# Altium project dawgg.PrjPcb
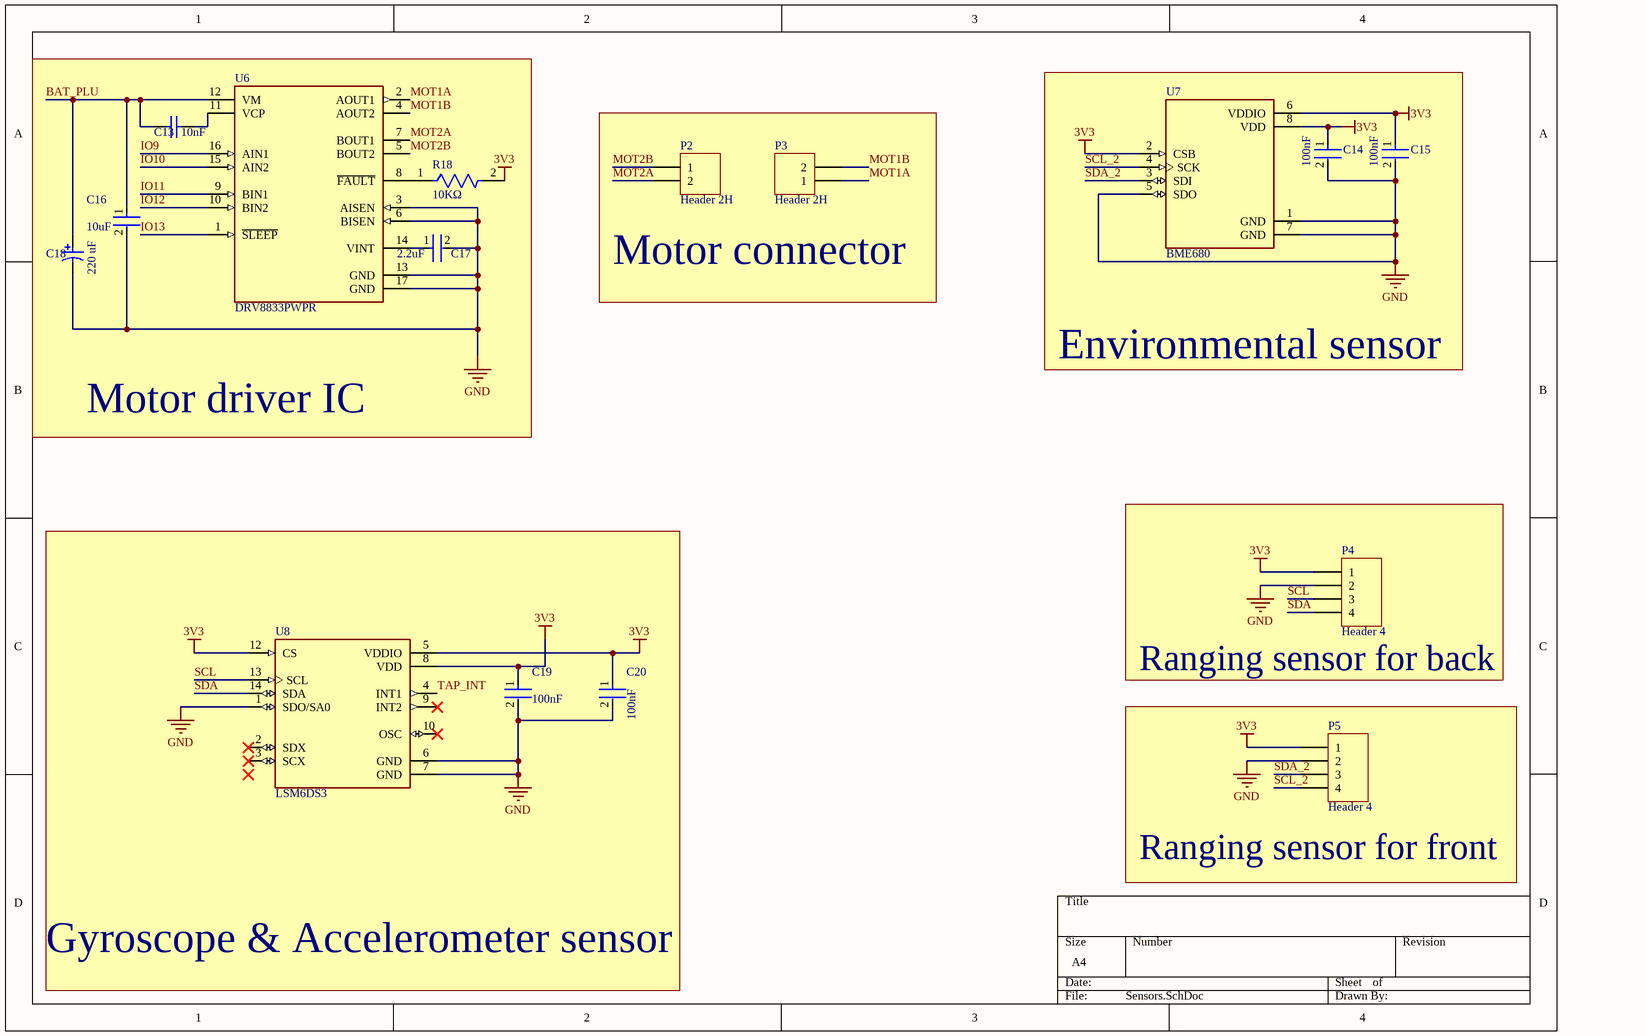
[diagram p0: Sensors.SchDoc]
3 sheets, 65 parts. Net scope: global (net labels, ports and power ports of the same name join across sheets).
Board file: PCB1.PcbDoc
Sheets:
  Sensors.SchDoc
  Power.SchDoc
  mcu.SchDoc

## Sheet Sensors.SchDoc
size A4; SheetNumber: 1; SheetTotal: 3

### Parts
C13  value 10nF  [CAPC0805(2012)145_N]  (hidden comment: CAP 10nF 50V 0805(2012))
C14  Capacitance: 100nF  [FP-CC0805-EB-IPC_B]  (hidden comment: CC0805KKX7RYBB104)
C15  Capacitance: 100nF  [FP-CC0805-EB-IPC_B]  (hidden comment: CC0805KKX7RYBB104)
C16  Capacitance: 10uF  [FP-C0805C106J8RACAUTO-MFG]  (hidden comment: C0805C106J8RACAUTO)
C17  Capacitance: 2.2uF  [FP-0805-L_2_01_0_2-W_1_25-MFG]  (hidden comment: 08053C225K4Z2A)
C18  Rated Capacitance: 220 uF  [NIC-CAPA2-8X10_V]  (hidden comment: UUD1V221MNL1GS)
C19  Capacitance: 100nF  [FP-CC0805-EB-IPC_B]  (hidden comment: CC0805KKX7RYBB104)
C20  Capacitance: 100nF  [FP-CC0805-EB-IPC_B]  (hidden comment: CC0805KKX7RYBB104)
P2  Header 2H  [HDR1X2H]
P3  Header 2H  [HDR1X2H]
P4  Header 4  [HDR1X4]
P5  Header 4  [HDR1X4]
R18  value 10KΩ  [FP-RT0805-IPC_B]  (hidden comment: RT0805FRD0710KL)
U6  DRV8833PWPR  [FP-PWP0016C-IPC_B]
U7  BME680  [PSON80P300X300X100-8N]
U8  LSM6DS3  [PQFN50P300X250X86-14N]

### Blocks framed on the sheet
Motor driver IC: C13 C16-C18 R18 U6
Environmental sensor: C14 C15 U7
Motor connector: P2 P3
Ranging sensor for back: P4
Gyroscope & Accelerometer sensor: C19 C20 U8
Ranging sensor for front: P5

### Nets
3V3: C14.1 C15.1 C19.1 C20.1 P4.1 P5.1 R18.2 U7.2(CSB) U7.6(VDDIO) U7.8(VDD) U8.5(VDDIO) U8.8(VDD) U8.12(CS)
GND: C14.2 C15.2 C16.2 C17.2 C18.2 C19.2 C20.2 P4.2 P5.2 U6.3(AISEN) U6.6(BISEN) U6.13(GND) U6.17(GND) U7.1(GND) U7.5(SDO) U7.7(GND) U8.1(SDO/SA0) U8.6(GND) U8.7(GND)
BAT_PLU: C13.1 C16.1 C18.1 U6.12(VM)
IO9: U6.16(AIN1)
IO10: U6.15(AIN2)
IO11: U6.9(BIN1)
IO12: U6.10(BIN2)
IO13: U6.1(~{SLEEP})
MOT1A: P3.1 U6.2(AOUT1)
MOT1B: P3.2 U6.4(AOUT2)
MOT2A: P2.2 U6.7(BOUT1)
MOT2B: P2.1 U6.5(BOUT2)
SCL: P4.3 U8.13(SCL)
SCL_2: P5.4 U7.4(SCK)
SDA: P4.4 U8.14(SDA)
SDA_2: P5.3 U7.3(SDI)
TAP_INT: U8.4(INT1)
NetC13_2: C13.2 U6.11(VCP)
NetC17_1: C17.1 U6.14(VINT)
NetR18_1: R18.1 U6.8(~{FAULT})

Not connected (* = marked no-connect by the designer): U8 2(SDX)* 3(SCX)* 9(INT2)* 10(OSC)*

### Library data of the parts
C13 = CMP-1036-03843-1: CAP 10nF 50V ±10% 0805 (2012 Metric) Thickness 1.45mm SMD; Case-EIA: 0805; Tolerance: Â±10%; Case-Metric: 2012; Technology: SMT; Max Thickness: 1.45 mm; Rated Voltage: 50 V; LCSC Part: C377773
C14 C15 C19 C20 = CMP-00621-107850848-1: CC0805KKX7RYBB104 Capacitor Ceramic 0.01uF 250V X7R 10% 0805 T/R; Material: Ceramic; Max Operating Temperature: 125°C; Tolerance: 10%; Case/Package: 0805; NexarPartId: 107850848; Height: 1.45mm; Min Operating Temperature: -55°C; Voltage Rating: 250V; LCSC Part: C28233
C16 = CMP-03020-034708-1: CAP CER 10UF 10V X7R 0805; Tolerance: 5%; Mount: Surface Mount; Voltage Rating: 10V; Max Operating Temperature: 125°C; Min Operating Temperature: -55°C; Case/Package: 0805; RoHS Compliant: Yes; Packaging: Tape and Reel; Case Code (Imperial): 0805; Case Code (Metric): 2012; Ratings: AEC-Q200; LCSC Part: C15850
C17 = CMP-04427-000048-1: CAP CER 2.2UF 25V X7R 0805; Tolerance: 10%; Voltage Rating: 25V; Packaging: Tape and Reel; Case/Package: 0805; Case Code (Imperial): 0805; Max Operating Temperature: 125°C; Features: Soft Termination; Ratings: AEC-Q200; Mount: Surface Mount; Case Code (Metric): 2012; Min Operating Temperature: -55°C; LCSC Part: C377773
C18 = CMP-0687-00080-1: Aluminum Electrolytic Capacitor, UD Series, Low Impedance, 220 uF, 35 V, + / - 20%, -55 to 105 degC, Chip Type, 8 x 10 mm D x L, Pb-Free, Reel; Manufacturer: Nichicon; Tolerance Rated Capacitance: -20 to 20%; Rated Voltage: 35 V; Packing: Dia382mm Reel; Impedance: 0.17 Ohm; Endurance Time: 5000 h; Rated Ripple Current (at 100kHz): 450 mA; ComponentLink3URL: http://products.nichicon.co.jp/en/pdf/XJA043/e-ud.pdf; DatasheetVersion: 08/2012; PackageDescription: 2-Pin Surface Mount Device, Diameter 8 mm, Height 10 mm, Pitch 6.5 mm; Length: 10 mm; ComponentLink3Description: Package Specification; RoHS: TRUE; ComponentLink1URL: http://www.nichicon.co.jp/; PartNumber: UUD1V221MNL1GS; ComponentLink2Description: Datasheet; ComponentLink2URL: http://products.nichicon.co.jp/en/pdf/XJA043/e-ud.pdf; PackageReference: CAPAE-D8H10; Diameter: 8 mm; Mounting Technology: Surface Mount; ComponentLink1Description: Manufacturer URL; LCSC Part: C2836441
P2 P3 = Header 2H: Header, 2-Pin, Right Angle; LatestRevisionDate: 17-Jul-2002; LatestRevisionNote: Re-released for DXP Platform.; Publisher: Altium Limited; LCSC Part: C32713261
P4 P5 = Header 4: Header, 4-Pin; LatestRevisionDate: 17-Jul-2002; LatestRevisionNote: Re-released for DXP Platform.; Publisher: Altium Limited; LCSC Part: C42431787
R18 = CMP-03412-035478-1: RES SMD 10K OHM 1% 1/8W 0805; Manufacturer: Yageo; Tolerance: 0.0001; Temperature Coefficient: 25 ppm/°C; Power Rating: 0.125W; Voltage Rating: 150V; RoHS: TRUE; Footprint Url: http://www.yageo.com/exep/pages/download/literatures/PYu-R_Mount_10.pdf; Series: RT; Octopart: https://octopart.com/rt0805frd0710kl-yageo-71399701; Digikey Description: RES SMD 10K OHM 1% 1/8W 0805; Composition: Thin Film; Manufacturer Part Number: RT0805FRD0710KL; Device Class L1: Passive Components; Automotive: No; ComponentLink2Description: Datasheet; Ipc Land Pattern Name: RESC200125X50; Device Class L2: Resistors; Resistance: 10KΩ; Temperature Range Low: -55°C; Device Class L3: Chip SMD Resistors; ComponentLink2URL: http://www.yageo.com/documents/recent/PYu-RT_1-to-0.01_RoHS_L_9.pdf; Temperature: -55°C to +155°C; Category: Res; Temperature Range High: +155°C; Lead Free: Yes; Package: RT0805; Height: 0.6mm; LCSC Part: C17414
U6 = CMP-1529-00004-3: IC MOTOR DRIVER PAR 16HTSSOP; Supply Current: 3mA; Max Output Current: 2A; Interface: PWM; Output Current: 1.5A; Max Supply Voltage: 10.8V; Fault Protection: Over Temperature; Number of Outputs: 2; Min Supply Voltage: 2.7V; Nominal Supply Current: 3mA; Series: DRV8833; Min Operating Temperature: -40°C; Package Quantity: 2000; Packaging: Tape and Reel; Case/Package: HTSSOP; Output Current per Channel: 1.5A; RoHS Compliant: Yes; RMS Current (Irms): 1.5A; Max Operating Temperature: 85°C; Technology: NMOS; Number of Pins: 16; Radiation Hardening: No; Lead Free: Lead Free; REACH SVHC: No SVHC; LCSC Part: C50506
U7 = BME680: Gas, Humidity, Pressure, Temperature Sensor I2C, SPI Output; MF: Bosch Sensortec; SnapEDA_Link: https://www.snapeda.com/parts/BME680/Bosch+Sensortec/view-part/?ref=snap; Package: LGA-8 Bosch Tools; Value: *; MP: BME680; Check_prices: https://www.snapeda.com/parts/BME680/Bosch+Sensortec/view-part/?ref=eda; LCSC Part: C125972
U8 = LSM6DS3: Accelerometer, Gyroscope, Temperature, 6 Axis Sensor IÂ²C, SPI Output; MF: STMicroelectronics; Value: *; SnapEDA_Link: https://www.snapeda.com/parts/LSM6DS3/STMicroelectronics/view-part/?ref=snap; MP: LSM6DS3; Check_prices: https://www.snapeda.com/parts/LSM6DS3/STMicroelectronics/view-part/?ref=eda; Purchase-URL: https://pricing.snapeda.com/search/part/LSM6DS3/?ref=eda; Availability: In Stock; Price: None; Package: Package; LCSC Part: LSM6DS3TR-C

## Sheet Power.SchDoc
size A4; SheetNumber: 2; SheetTotal: 3; SPICEModelCacheVEIOBZSK: <root> / <DocumentId>VEIOBZSK</DocumentId> / </root>
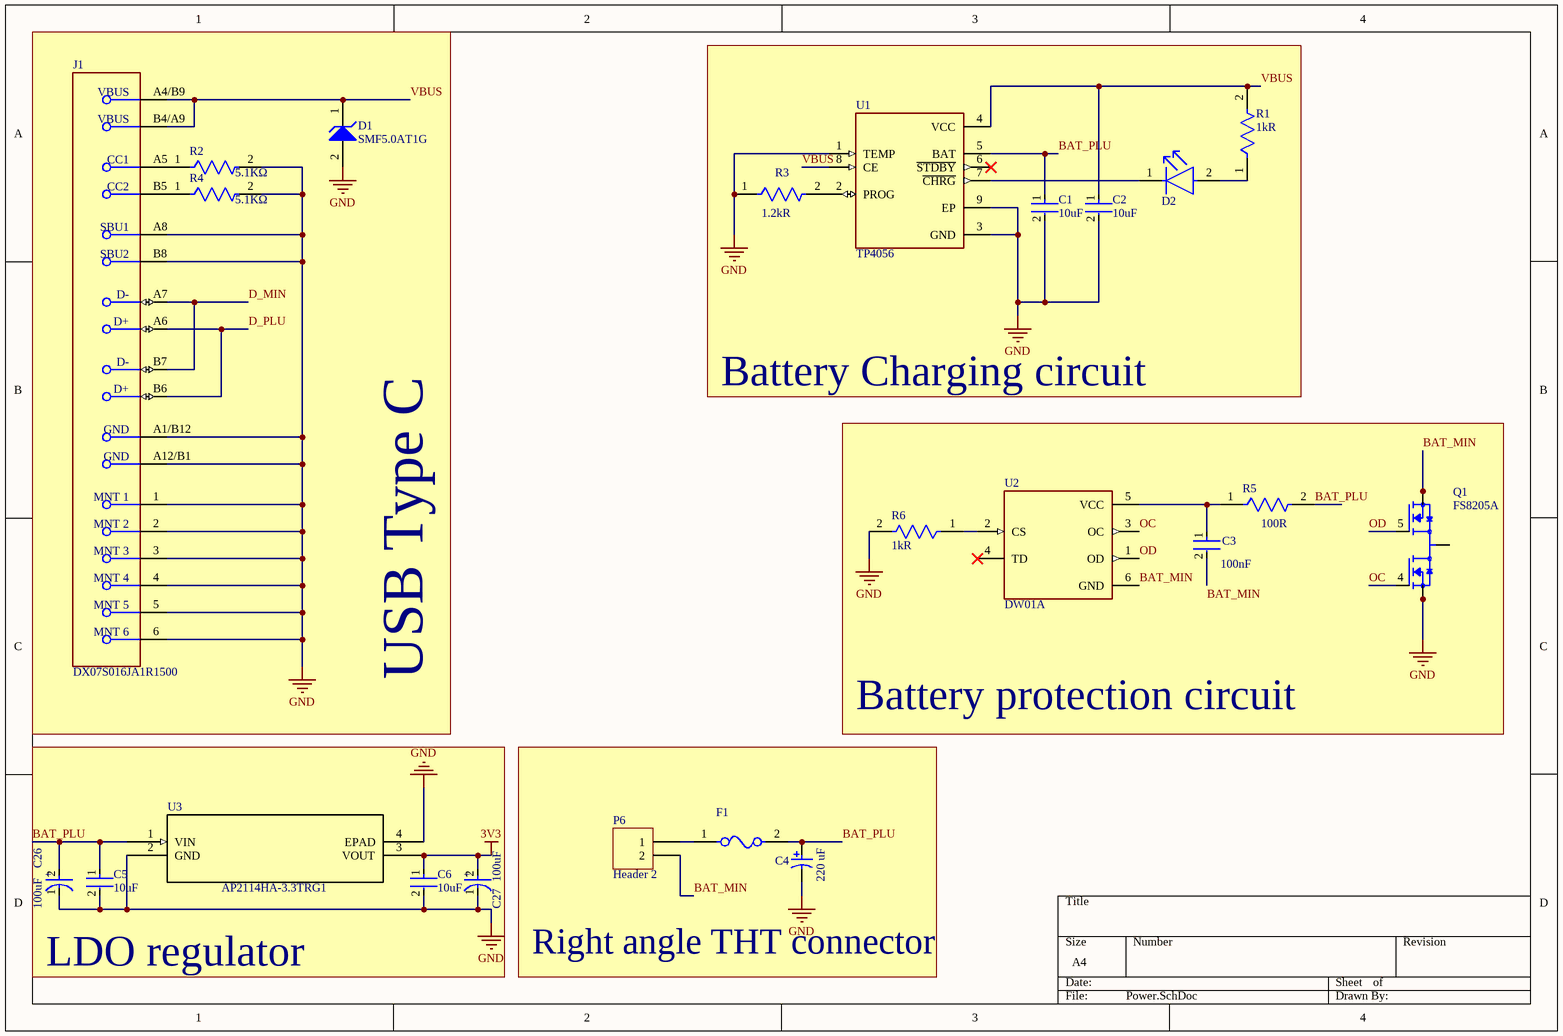
[diagram p1: Power.SchDoc]

### Parts
C1  Capacitance: 10uF  [FP-C0805C106J8RACAUTO-IPC_B]  (hidden comment: C0805C106J8RACAUTO)
C2  Capacitance: 10uF  [FP-C0805C106J8RACAUTO-MFG]  (hidden comment: C0805C106J8RACAUTO)
C3  Capacitance: 100nF  [FP-CC0805-EB-IPC_B]  (hidden comment: CC0805KKX7RYBB104)
C4  Rated Capacitance: 220 uF  [NIC-CAPA2-8X10_V]  (hidden comment: UUD1V221MNL1GS)
C5  Capacitance: 10uF  [FP-C0805C106J8RACAUTO-IPC_B]  (hidden comment: C0805C106J8RACAUTO)
C6  Capacitance: 10uF  [FP-C0805C106J8RACAUTO-IPC_B]  (hidden comment: C0805C106J8RACAUTO)
C26  Capacitance: 100uF  [FP-POSCAP-D2-MFG]  (hidden comment: 10TPC100M)
C27  Capacitance: 100uF  [FP-POSCAP-D2-MFG]  (hidden comment: 10TPC100M)
D1  SMF5.0AT1G  [ONSC-SOD-123FL-2-498_V]
D2  SML-LXT0805IW-TR  [FP-SML-LXT0805IW-TR-MFG]  (value not drawn)
F1  MF-NSMF200-2  [FP-MF-NSMF200-2-MFG]  (value not drawn)
J1  DX07S016JA1R1500  [FP-DX07S016JA1R1500-MFG]
P6  Header 2  [HDR1X2]
Q1  FS8205A  [SOP65P640X120-8N]
R1  Resistance: 1kR  [FP-MCU0805-IPC_B]  (hidden comment: MCU0805MD1001BP100)
R2  value 5.1KΩ  [FP-AC0805-IPC_B]  (hidden comment: AC0805JR-075K1L)
R3  Resistance: 1.2kR  [FP-RMCF0805-IPC_B]  (hidden comment: RMCF0805JG1K20)
R4  value 5.1KΩ  [FP-AC0805-IPC_B]  (hidden comment: AC0805JR-075K1L)
R5  Resistance: 100R  [FP-CRCW0805-HPe3-IPC_B]  (hidden comment: CRCW0805100RJNEAHP)
R6  Resistance: 1kR  [FP-MCU0805-IPC_B]  (hidden comment: MCU0805MD1001BP100)
U1  TP4056  [SOP127P600X175-9N]
U2  DW01A  [SOT95P280X145-6N]
U3  AP2114HA-3.3TRG1  [SOT-223_DIO]

### Blocks framed on the sheet
USB Type C: D1 J1 R2 R4
Battery Charging circuit: C1 C2 D2 R1 R3 U1
Battery protection circuit: C3 Q1 R5 R6 U2
LDO regulator: C5 C6 C26 C27 U3
Right angle THT connector: C4 F1 P6

### Nets
3V3: C6.1 C27.2(A) U3.3(VOUT)
GND: C1.2 C2.2 C4.2 C5.2 C6.2 C26.1(C) C27.1(C) D1.2(A) J1.1(MNT_1) J1.2(MNT_2) J1.3(MNT_3) J1.4(MNT_4) J1.5(MNT_5) J1.6(MNT_6) J1.A1/B12(GND) J1.A8(SBU1) J1.A12/B1(GND) J1.B8(SBU2) Q1.2(S1) Q1.3(S1) R2.2 R3.1 R4.2 R6.2 U1.1(TEMP) U1.3(GND) U1.9(EP) U3.2(GND) U3.4(EPAD)
BAT_MIN: C3.2 P6.2 Q1.6(S2) Q1.7(S2) U2.6(GND)
BAT_PLU: C1.1 C4.1 C5.1 C26.2(A) F1.2 R5.2 U1.5(BAT) U3.1(VIN)
D_MIN: J1.A7(D-) J1.B7(D-)
D_PLU: J1.A6(D+) J1.B6(D+)
OC: Q1.4(G1) U2.3(OC)
OD: Q1.5(G2) U2.1(OD)
VBUS: C2.1 D1.1(K) J1.A4/B9(VBUS) J1.B4/A9(VBUS) R1.2 U1.4(VCC) U1.8(CE)
NetC3_1: C3.1 R5.1 U2.5(VCC)
NetD2_1: D2.1(C) U1.7(~{CHRG})
NetD2_2: D2.2(A) R1.1
NetF1_1: F1.1 P6.1
NetJ1_A5: J1.A5(CC1) R2.1
NetJ1_B5: J1.B5(CC2) R4.1
NetQ1_1: Q1.1(D12) Q1.8(D12)
NetR3_2: R3.2 U1.2(PROG)
NetR6_1: R6.1 U2.2(CS)

Not connected (* = marked no-connect by the designer): U1 6(~{STDBY})*; U2 4(TD)*

### Notes on the sheet
- (in symbol CMP-05428-000328-1) +

### Library data of the parts
C1 C2 C5 C6 = CMP-03020-034708-1: CAP CER 10UF 10V X7R 0805; Tolerance: 5%; Mount: Surface Mount; Voltage Rating: 10V; Max Operating Temperature: 125°C; Min Operating Temperature: -55°C; Case/Package: 0805; RoHS Compliant: Yes; Packaging: Tape and Reel; Case Code (Imperial): 0805; Case Code (Metric): 2012; Ratings: AEC-Q200; LCSC Part: C15850
C3 = CMP-00621-107850848-1: as C14 on sheet Sensors; Material: Ceramic; Max Operating Temperature: 125°C; Tolerance: 10%; Case/Package: 0805; NexarPartId: 107850848; Height: 1.45mm; Min Operating Temperature: -55°C; Voltage Rating: 250V; LCSC Part: C28233
C4 = CMP-0687-00080-1: as C18 on sheet Sensors; ComponentLink3URL: http://products.nichicon.co.jp/en/pdf/XJA043/e-ud.pdf; DatasheetVersion: 08/2012; PackageDescription: 2-Pin Surface Mount Device, Diameter 8 mm, Height 10 mm, Pitch 6.5 mm; Length: 10 mm; ComponentLink3Description: Package Specification; RoHS: TRUE; ComponentLink1URL: http://www.nichicon.co.jp/; PartNumber: UUD1V221MNL1GS; ComponentLink2Description: Datasheet; ComponentLink2URL: http://products.nichicon.co.jp/en/pdf/XJA043/e-ud.pdf; PackageReference: CAPAE-D8H10; Diameter: 8 mm; Mounting Technology: Surface Mount; ComponentLink1Description: Manufacturer URL; LCSC Part: C2836441
C26 C27 = CMP-05428-000328-1: Molded Tantalum Polymer Capacitor 100uF 20% 10V life 2000Hours SMD 2917; ESR (Equivalent Series Resistance): 45mR; Dissipation Factor: 10%; Leakage Current: 100uA; Ripple Current: 1.7A; Polarity: Polar; Height: 1.9mm; Case Code (Imperial): 2917; Depth: 4.3mm; Voltage Rating: 10V; Case/Package: 2917; Max Operating Temperature: 105°C; REACH SVHC: No SVHC; Voltage Rating (DC): 10V; Radiation Hardening: No; Voltage: 10V; Termination: SMD/SMT; Number of Pins: 2; Features: General Purpose; Min Operating Temperature: -55°C; Series: POSCAP™ TPC; Tolerance: 20%; Packaging: Tape and Reel; Package Quantity: 3000; Height - Seated (Max): 0.079inch; RoHS Compliant: Yes; Case Code (Metric): 7343; Length: 7.3mm; Lead Free: Lead Free; Mount: Surface Mount; Construction: Flat; Width: 4.3mm; LCSC Part: C7222
D1 = CMP-1061-00612-1: 200 W Transient Voltage Suppressor, 2-Pin SOD-123FL, Pb-Free, Tape and Reel; Manufacturer: On Semiconductor; Direction: Unidirectional; IR Max (uA): 400; V(BR) Typ (V): 6.7; PackageDescription: 2-Pin SOD, Body 1.65 x 2.7 mm; PartNumber: SMF5.0AT1G; ComponentLink3Description: Package Specification; ComponentLink3URL: http://www.onsemi.com/pub_link/Collateral/498-01.PDF; PackageVersion: Rev. D, 05/2013; Mounting Technology: Surface Mount; PackageReference: SOD-123FL-2-498; ComponentLink2URL: http://www.onsemi.com/pub_link/Collateral/SMF5.0AT1-D.PDF; DatasheetVersion: Rev. 7; ComponentLink1Description: Manufacturer URL; Packing: Tape and Reel; RoHS: Pb-Free; ComponentLink1URL: http://www.onsemi.com/; ComponentLink2Description: Datasheet; LCSC Part: C2857263
D2 = CMP-1724-00002-2: LED RED DIFFUSED SMD; Lens Style: Rectangular; Luminous Intensity: 11mcd; Approvals: UL; Test Current: 20mA; Forward Voltage: 2V; Number of LEDs: 1; Wavelength: 635nm; Lens Color: White; Viewing Angle: 140°; Min Operating Temperature: -25°C; Case Code (Metric): 2012; Mount: Surface Mount; Case Code (Imperial): 0805; Height: 0.8mm; Lead Free: Lead Free; Color: Red; Package Quantity: 1; Illumination Color: Red; Lens Transparency: Diffused; Forward Current: 20mA; Packaging: Tape and Reel; Length: 2mm; Case/Package: 0805; REACH SVHC: No SVHC; Width: 1.25mm; Number of Pins: 2; Max Operating Temperature: 80°C; Dominant Wavelength: 635nm; LCSC Part: C2297
F1 = CMP-07400-000004-1: PTC RESET FUSE 6V 2A 1206; Manufacturer: Bourns Inc.; Trip Time: 1s; Automotive Grade: Grade 3; Value: 85mΩ; Trip Current: 4A; Current Rating: 100A; RoHS: TRUE; Device Class L1: Circuit Protection; Manufacturer Part Number: MF-NSMF200-2; Height: 1.6mm; Device Class L3: unset; Ambient Temperature Range Low: -40°C; ComponentLink2URL: https://bourns.com/docs/product-datasheets/mfnsmf.pdf?sfvrsn=39c76af6_14; Lead Free: Yes; Temperature Range High: +85°C; Temperature Range Low: -40°C; Octopart: https://octopart.com/mf-nsmf200-2-bourns-90790; Ipc Land Pattern Name: CAPC325160X115; Device Class L2: PTC Resettable Fuses; ComponentLink2Description: Datasheet; Package: MF-NSMF200-2; Voltage Rating: 6V; Mouser Description: Resettable Fuses - PPTC 2V 6V 0.02ohm (R); Ambient Temperature Range High: +85°C; Hold Current: 2A; Digikey Description: PTC RESET FUSE 6V 2A 1206; Category: Fuse; Temperature: -40°C to +85°C; Automotive: Yes; Resistance: 85mΩ; LCSC Part: C269120
J1 = CMP-19038-000003-1: CONN RCP USB2.0 TYP C 24P SMD RA; LCSC Part: C3197885
P6 = Header 2: Header, 2-Pin; LatestRevisionDate: 17-Jul-2002; LatestRevisionNote: Re-released for DXP Platform.; Publisher: Altium Limited; LCSC Part: C32713268
Q1 = FS8205A: MF: Fortune Semiconductor; SnapEDA_Link: https://www.snapeda.com/parts/FS8205A/Fortune+Semiconductor/view-part/?ref=snap; Package: Package; Value: *; MP: FS8205A; Check_prices: https://www.snapeda.com/parts/FS8205A/Fortune+Semiconductor/view-part/?ref=eda; LCSC Part: C5148694
R1 R6 = CMP-02407-000288-1: RES 1.05K OHM 0.5% 1/5W 0805; Tolerance: 0.1%; Power Rating: 200mW; Voltage Rating: 150V; Max Operating Temperature: 155°C; Width: 1.25mm; Min Operating Temperature: -55°C; Case Code (Metric): 2012; Packaging: Tape and Reel; Case Code (Imperial): 0805; Length: 2mm; Height: 0.52mm; Case/Package: 0805; Weight: 0.000162oz; Composition: Thin Film; LCSC Part: C17513
R2 R4 = CMP-2001-04477-2: RES SMD 5.1K OHM 5% 1/8W 0805; Manufacturer: Yageo; Automotive Grade: Grade 0; Voltage Rating: 150V; Tolerance: 0.05; Category: Res; RoHS: TRUE; Automotive: Yes; Device Class L1: Passive Components; Lead Free: Yes; Octopart: https://octopart.com/ac0805jr-075k1l-yageo-21711115; Series: AC; Temperature Range High: +155°C; ComponentLink2URL: http://www.yageo.com/documents/recent/PYu-AC_51_RoHS_L_6.pdf; Temperature Range Low: -55°C; ComponentLink2Description: Datasheet; Footprint Url: http://www.yageo.com/exep/pages/download/literatures/PYu-R_Mount_10.pdf; Mouser Description: Thick Film Resistors - SMD 5.1K ohm 5% 1/8W; Device Class L3: Chip SMD Resistors; Digikey Description: RES SMD 5.1K OHM 5% 1/8W 0805; Power Rating: 1/8W; Package: AC0805; Temperature: -55°C to +155°C; Device Class L2: Resistors; Resistance: 5.1KΩ; Height: 0.6mm; Manufacturer Part Number: AC0805JR-075K1L; Ipc Land Pattern Name: RESC200125X50; Composition: Thick Film; LCSC Part: C27834
R3 = CMP-26527-005543-1: 1.2kΩ ±5% 0.125W 0805 Thick Film Chip Resistor AEC-Q200 compliant; Temperature Coefficient: 200ppm/°C; Max Power Dissipation: 125mW; RoHS Compliant: Yes; Width: 0.049inch; Max Operating Temperature: 155°C; Features: Automotive AEC-Q200; Contact Plating: Tin; Series: RMCF; Height: 0.026inch; Radiation Hardening: No; Packaging: Tape and Reel; Number of Terminations: 2; Length: 0.079inch; Min Operating Temperature: -55°C; Resistor Type: Thick Film; Case/Package: 0805; Tolerance: 5%; Mount: Surface Mount; LCSC Part: C17379
R5 = CMP-02407-002130-1: RES Thick Film, 100Ω, 5%, 0.5W, 200ppm/°C, 0805; Voltage Rating: 150V; Power Rating: 330mW; Max Power Dissipation: 333mW; Max Operating Temperature: 155°C; Temperature Coefficient: 200ppm/°C; Case Code (Imperial): 0805; Lead Free: Lead Free; Composition: Thick Film; Case/Package: 0805; Package Quantity: 1; Number of Terminations: 2; Contact Plating: Tin; Radiation Hardening: No; Case Code (Metric): 2012; Height: 0.024inch; Features: Automotive AEC-Q200; Length: 0.079inch; Tolerance: 5%; Width: 0.049inch; Packaging: Tape and Reel; Termination: SMD/SMT; Weight: 0.000194oz; Min Operating Temperature: -55°C; LCSC Part: C17408
U1 = TP4056: Complete single cell Li-Ion battery with a constant current / constant voltage linear charger; MF: NanJing Top Power ASIC Corp.; Check_prices: https://www.snapeda.com/parts/TP4056/NanJing+Top+Power+ASIC+Corp./view-part/?ref=eda; SnapEDA_Link: https://www.snapeda.com/parts/TP4056/NanJing+Top+Power+ASIC+Corp./view-part/?ref=snap; Price: None; Availability: Not in stock; Package: Package; MP: TP4056; Value: *; LCSC Part: C16581
U2 = DW01A: One Cell Lithium-ion/Polymer Battery Protection IC; MF: Fortune Semiconductor; SnapEDA_Link: https://www.snapeda.com/parts/DW01A/Fortune+Semiconductor/view-part/?ref=snap; Package: SOT-23-6 Fortune Semiconductor; Value: *; MP: DW01A; Check_prices: https://www.snapeda.com/parts/DW01A/Fortune+Semiconductor/view-part/?ref=eda; LCSC Part: C18164398
U3 = AP2114HA-3.3TRG1: Description; Manufacturer_Name: Diodes Inc; Copyright: Copyright (C) 2025 Ultra Librarian. All rights reserved.; Manufacturer_Part_Number: AP2114HA-3.3TRG1; RefDes: RefDes; Type: Type; LCSC Part: C460314

## Sheet mcu.SchDoc
size A4; SheetNumber: 3; SheetTotal: 3
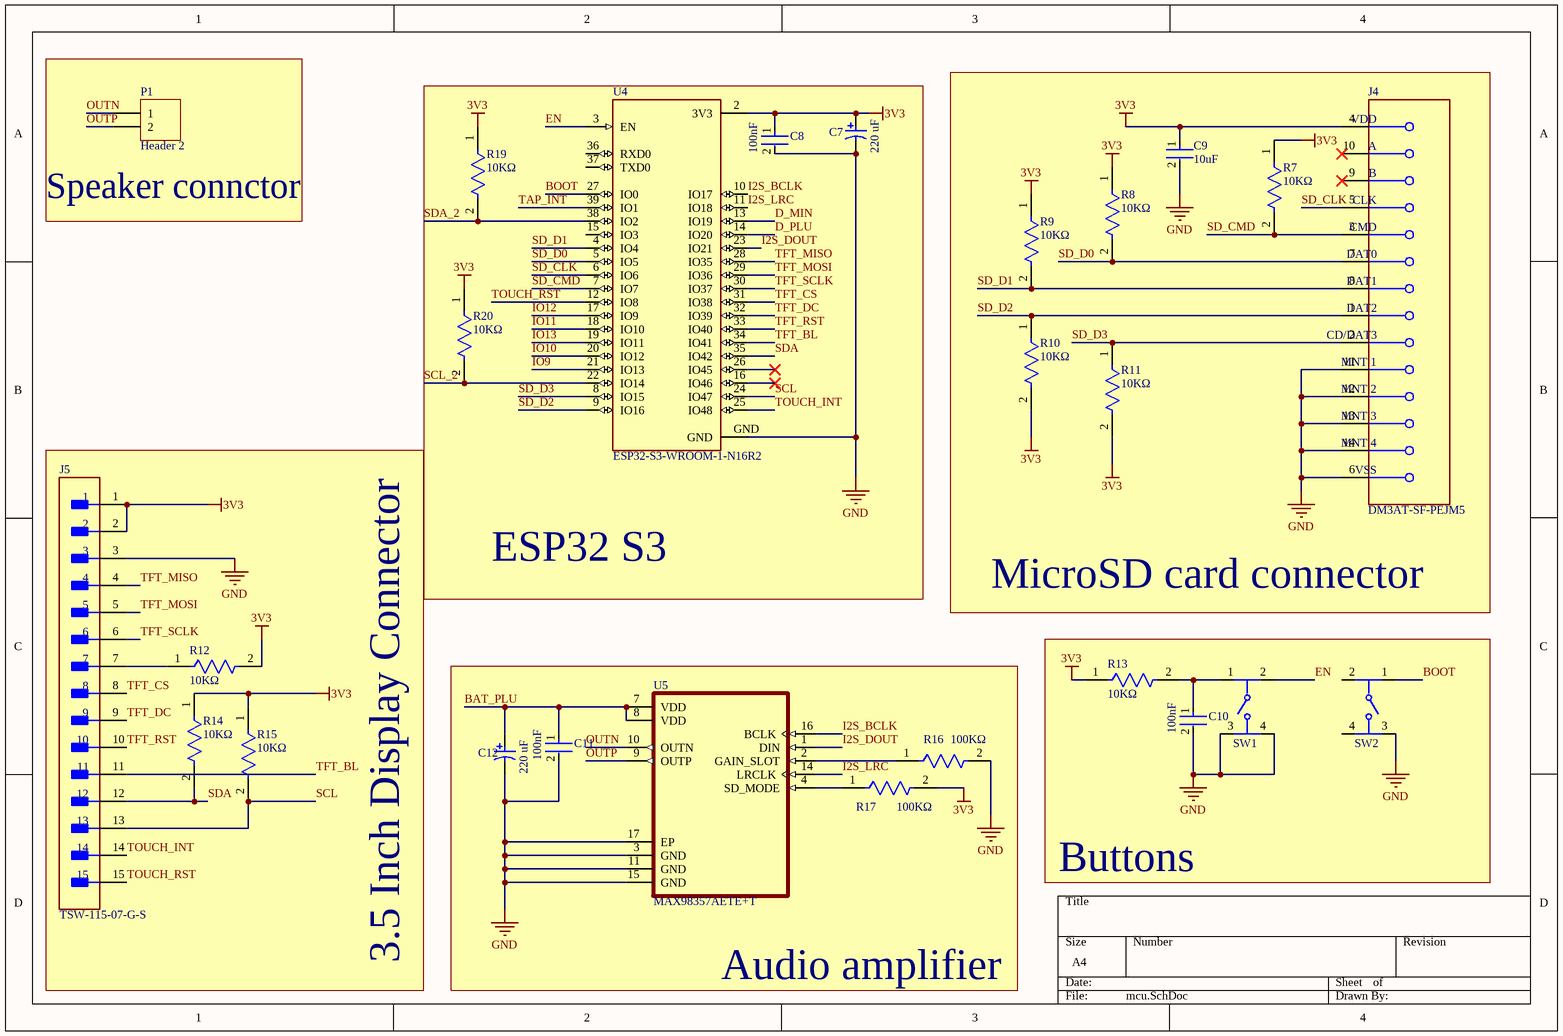
[diagram p2: mcu.SchDoc]

### Parts
C7  Rated Capacitance: 220 uF  [NIC-CAPA2-8X10_V]  (hidden comment: UUD1V221MNL1GS)
C8  Capacitance: 100nF  [FP-CC0805-EB-IPC_B]  (hidden comment: CC0805KKX7RYBB104)
C9  Capacitance: 10uF  [FP-C0805C106J8RACAUTO-IPC_B]  (hidden comment: C0805C106J8RACAUTO)
C10  Capacitance: 100nF  [FP-CC0805-EB-IPC_B]  (hidden comment: CC0805KKX7RYBB104)
C11  Capacitance: 100nF  [FP-CC0805-EB-IPC_B]  (hidden comment: CC0805KKX7RYBB104)
C12  Rated Capacitance: 220 uF  [NIC-CAPA2-8X10_V]  (hidden comment: UUD1V221MNL1GS)
J4  DM3AT-SF-PEJM5  [FP-DM3AT-SF-PEJM5-MFG]
J5  TSW-115-07-G-S  [FP-TSW-115-07-G-S-MFG]
P1  Header 2  [HDR1X2]
R7  value 10KΩ  [FP-RT0805-IPC_B]  (hidden comment: RT0805FRD0710KL)
R8  value 10KΩ  [FP-RT0805-IPC_B]  (hidden comment: RT0805FRD0710KL)
R9  value 10KΩ  [FP-RT0805-IPC_B]  (hidden comment: RT0805FRD0710KL)
R10  value 10KΩ  [FP-RT0805-IPC_B]  (hidden comment: RT0805FRD0710KL)
R11  value 10KΩ  [FP-RT0805-IPC_B]  (hidden comment: RT0805FRD0710KL)
R12  value 10KΩ  [FP-RT0805-IPC_B]  (hidden comment: RT0805FRD0710KL)
R13  value 10KΩ  [FP-RT0805-IPC_B]  (hidden comment: RT0805FRD0710KL)
R14  value 10KΩ  [FP-RT0805-IPC_B]  (hidden comment: RT0805FRD0710KL)
R15  value 10KΩ  [FP-RT0805-IPC_B]  (hidden comment: RT0805FRD0710KL)
R16  value 100KΩ  [FP-RT0805-MFG]  (hidden comment: RT0805DRD07100KL)
R17  value 100KΩ  [FP-RT0805-MFG]  (hidden comment: RT0805DRD07100KL)
R19  value 10KΩ  [FP-RT0805-IPC_B]  (hidden comment: RT0805FRD0710KL)
R20  value 10KΩ  [FP-RT0805-IPC_B]  (hidden comment: RT0805FRD0710KL)
SW1  2-1977223-2  [FP-2-1977223-2-MFG]  (value not drawn)
SW2  2-1977223-2  [FP-2-1977223-2-MFG]  (value not drawn)
U4  ESP32-S3-WROOM-1-N16R2  [XCVR_ESP32-S3-WROOM-1-N16R2]
U5  MAX98357AETE+T  [QFN50P300X300X80-17N]

### Blocks framed on the sheet
Speaker connctor: P1
ESP32 S3: C7 C8 R19 R20 U4
MicroSD card connector: C9 J4 R7-R11
3.5 Inch Display Connector: J5 R12 R14 R15
Audio amplifier: C11 C12 R16 R17 U5
Buttons: C10 R13 SW1 SW2

### Nets
3V3: C7.1 C8.1 C9.1 J4.4(VDD) J5.1 J5.2 R7.1 R8.1 R9.1 R10.2 R11.2 R12.2 R13.1 R14.1 R15.1 R17.2 R19.1 R20.1 U4.2(3V3)
GND: C7.2 C8.2 C9.2 C10.2 C11.2 C12.2 J4.6(VSS) J4.11(MNT_1) J4.12(MNT_2) J4.13(MNT_3) J4.14(MNT_4) J5.3 R16.2 SW1.3 SW1.4 SW2.3 U4.GND U5.3(GND) U5.11(GND) U5.15(GND) U5.17(EP)
BAT_PLU: C11.1 C12.1 U5.7(VDD) U5.8(VDD)
BOOT: SW2.1 U4.27(IO0)
D_MIN: U4.13(IO19)
D_PLU: U4.14(IO20)
EN: SW1.2 U4.3(EN)
I2S_BCLK: U4.10(IO17) U5.16(BCLK)
I2S_DOUT: U4.23(IO21) U5.1(DIN)
I2S_LRC: U4.11(IO18) U5.14(LRCLK)
IO9: U4.21(IO13)
IO10: U4.20(IO12)
IO11: U4.18(IO10)
IO12: U4.17(IO9)
IO13: U4.19(IO11)
OUTN: P1.1 U5.10(OUTN)
OUTP: P1.2 U5.9(OUTP)
SCL: J5.13 R15.2 U4.24(IO47)
SCL_2: R20.2 U4.22(IO14)
SD_CLK: J4.5(CLK) U4.6(IO6)
SD_CMD: J4.3(CMD) R7.2 U4.7(IO7)
SD_D0: J4.7(DAT0) R8.2 U4.5(IO5)
SD_D1: J4.8(DAT1) R9.2 U4.4(IO4)
SD_D2: J4.1(DAT2) R10.1 U4.9(IO16)
SD_D3: J4.2(CD/DAT3) R11.1 U4.8(IO15)
SDA: J5.12 R14.2 U4.35(IO42)
SDA_2: R19.2 U4.38(IO2)
TAP_INT: U4.39(IO1)
TFT_BL: J5.11 U4.34(IO41)
TFT_CS: J5.8 U4.31(IO38)
TFT_DC: J5.9 U4.32(IO39)
TFT_MISO: J5.4 U4.28(IO35)
TFT_MOSI: J5.5 U4.29(IO36)
TFT_RST: J5.10 U4.33(IO40)
TFT_SCLK: J5.6 U4.30(IO37)
TOUCH_INT: J5.14 U4.25(IO48)
TOUCH_RST: J5.15 U4.12(IO8)
NetC10_1: C10.1 R13.2 SW1.1
NetJ5_7: J5.7 R12.1
NetR16_1: R16.1 U5.2(GAIN_SLOT)
NetR17_1: R17.1 U5.4(SD_MODE)

Not connected (* = marked no-connect by the designer): J4 9(B)* 10(A)*; SW2 2 4; U4 15(IO3) 16(IO46)* 26(IO45)* 36(RXD0) 37(TXD0)

### Library data of the parts
C7 C12 = CMP-0687-00080-1: as C18 on sheet Sensors; ComponentLink3URL: http://products.nichicon.co.jp/en/pdf/XJA043/e-ud.pdf; DatasheetVersion: 08/2012; PackageDescription: 2-Pin Surface Mount Device, Diameter 8 mm, Height 10 mm, Pitch 6.5 mm; Length: 10 mm; ComponentLink3Description: Package Specification; RoHS: TRUE; ComponentLink1URL: http://www.nichicon.co.jp/; PartNumber: UUD1V221MNL1GS; ComponentLink2Description: Datasheet; ComponentLink2URL: http://products.nichicon.co.jp/en/pdf/XJA043/e-ud.pdf; PackageReference: CAPAE-D8H10; Diameter: 8 mm; Mounting Technology: Surface Mount; ComponentLink1Description: Manufacturer URL; LCSC Part: C2836441
C8 C10 C11 = CMP-00621-107850848-1: as C14 on sheet Sensors; Material: Ceramic; Max Operating Temperature: 125°C; Tolerance: 10%; Case/Package: 0805; NexarPartId: 107850848; Height: 1.45mm; Min Operating Temperature: -55°C; Voltage Rating: 250V; LCSC Part: C28233
C9 = CMP-03020-034708-1: CAP CER 10UF 10V X7R 0805; Tolerance: 5%; Mount: Surface Mount; Voltage Rating: 10V; Max Operating Temperature: 125°C; Min Operating Temperature: -55°C; Case/Package: 0805; RoHS Compliant: Yes; Packaging: Tape and Reel; Case Code (Imperial): 0805; Case Code (Metric): 2012; Ratings: AEC-Q200; LCSC Part: C15850
J4 = CMP-2000-05150-2: CONN MICRO SD CARD PUSH-PUSH R/A; Current Rating: 500mA; Number of Contacts: 8; Pitch: 1.1mm; Gender: Female; Connector Type: Connector; Max Voltage Rating (AC): 125V; Min Operating Temperature: -25°C; Length: 15.95mm; Packaging: Tape and Reel; Width: 13.85mm; Flammability Rating: UL94 V-0; Termination: SMD/SMT; Contact Material: Copper Alloy; Depth: 15.95mm; Radiation Hardening: No; Number of Rows: 1; Max Operating Temperature: 85°C; Housing Material: Polymer; Height: 1.68mm; Package Quantity: 1; Orientation: Right Angle; REACH SVHC: No SVHC; Mount: Surface Mount; Max Current Rating: 500mA; Number of Positions: 8; Lead Free: Lead Free; Contact Plating: Gold; Voltage Rating: 125V; LCSC Part: C114218
J5 = CMP-02766-000090-1: CONN HEADER VERT 15POS 2.54MM; Manufacturer: SAMTEC; Conn Gender: Male; Number Of Contacts: 15; Conn Orientation: Vertical; Package: TSW-115-07-G-S; RoHS: TRUE; Manufacturer Part Number: TSW-115-07-G-S; Digikey Description: CONN HEADER VERT 15POS 2.54MM; Device Class L1: Connectors; Temperature Range Low: -55°C; Height: 8.71mm; Contact Material: Gold,Nickel; ComponentLink2URL: http://suddendocs.samtec.com/catalog_english/tsw_th.pdf; ComponentLink2Description: Datasheet; Category: Conn; Footprint Url: http://suddendocs.samtec.com/prints/tsw-xxx-xx-x-x-xx-xxx-footprint.pdf; Lead Free: Yes; Octopart: https://octopart.com/tsw-115-07-g-s-samtec-272210; Pitch: 2.54mm; Device Class L2: Headers and Wire Housings; Temperature: -55°C to +125°C; Number Of Rows: 1; Automotive: No; Device Class L3: unset; Temperature Range High: +125°C; LCSC Part: C2932704
P1 = Header 2: Header, 2-Pin; LatestRevisionDate: 17-Jul-2002; LatestRevisionNote: Re-released for DXP Platform.; Publisher: Altium Limited; LCSC Part: C32713268
R7-R15 R19 R20 = CMP-03412-035478-1: as R18 on sheet Sensors; RoHS: TRUE; Footprint Url: http://www.yageo.com/exep/pages/download/literatures/PYu-R_Mount_10.pdf; Series: RT; Octopart: https://octopart.com/rt0805frd0710kl-yageo-71399701; Digikey Description: RES SMD 10K OHM 1% 1/8W 0805; Composition: Thin Film; Manufacturer Part Number: RT0805FRD0710KL; Device Class L1: Passive Components; Automotive: No; ComponentLink2Description: Datasheet; Ipc Land Pattern Name: RESC200125X50; Device Class L2: Resistors; Resistance: 10KΩ; Temperature Range Low: -55°C; Device Class L3: Chip SMD Resistors; ComponentLink2URL: http://www.yageo.com/documents/recent/PYu-RT_1-to-0.01_RoHS_L_9.pdf; Temperature: -55°C to +155°C; Category: Res; Temperature Range High: +155°C; Lead Free: Yes; Package: RT0805; Height: 0.6mm; LCSC Part: C17414
R16 R17 = CMP-2001-01780-2: RES SMD 100K OHM 0.5% 1/8W 0805; Manufacturer: Yageo; Voltage Rating: 150V; Power Rating: 0.125W; Tolerance: 0.01; Temperature Coefficient: 25 ppm/°C; ComponentLink2Description: Datasheet; Height: 0.6mm; ComponentLink2URL: http://www.yageo.com/documents/recent/PYu-RT_1-to-0.01_RoHS_L_9.pdf; Resistance: 100KΩ; Series: RT; Digikey Description: RES SMD 100K OHM 0.5% 1/8W 0805; Temperature Range High: +155°C; Lead Free: Yes; Footprint Url: http://www.yageo.com/exep/pages/download/literatures/PYu-R_Mount_10.pdf; Octopart: https://octopart.com/rt0805drd07100kl-yageo-1251654; Manufacturer Part Number: RT0805DRD07100KL; Temperature: -55°C to +155°C; Category: Res; Automotive: No; RoHS: TRUE; Device Class L2: Resistors; Ipc Land Pattern Name: RESC200125X50; Temperature Range Low: -55°C; Device Class L1: Passive Components; Package: RT0805; Composition: Thin Film; Device Class L3: Chip SMD Resistors; LCSC Part: C25611
SW1 SW2 = CMP-03407-000026-1: SWITCH TACTILE SPST-NO 0.05A 24V; RoHS Compliant: Yes; LCSC Part: C557615
U4 = ESP32-S3-WROOM-1-N16R2: Bluetooth, WiFi 802.11b/g/n, Bluetooth v5.0 Transceiver Module 2.4GHz PCB Trace Surface Mount; MF: Espressif Systems; MP: ESP32S3WROOM1N16R2; SnapEDA_Link: https://www.snapeda.com/parts/ESP32S3WROOM1N16R2/Espressif+Systems/view-part/?ref=snap; Package: NON STANDARD Espressif Systems; Value: *; Check_prices: https://www.snapeda.com/parts/ESP32S3WROOM1N16R2/Espressif+Systems/view-part/?ref=eda; LCSC Part: C2913205
U5 = MAX98357AETE+T: Tiny, Low-Cost, PCM Class D Amplifier with Class AB Performance; MF: Analog Devices; SnapEDA_Link: https://www.snapeda.com/parts/MAX98357AETE+T/Analog+Devices/view-part/?ref=snap; Package: TQFN-16 Maxim; Value: *; MP: MAX98357AETE+T; Check_prices: https://www.snapeda.com/parts/MAX98357AETE+T/Analog+Devices/view-part/?ref=eda; LCSC Part: C910544

## Nets that join several sheets
3V3: Sensors (13 pins), Power (C6.1 C27.2 U3.3), mcu (19 pins)
GND: Sensors (19 pins), Power (29 pins), mcu (21 pins)
BAT_PLU: Sensors (C13.1 C16.1 C18.1 U6.12), Power (8 pins), mcu (C11.1 C12.1 U5.7 U5.8)
D_MIN: Power (J1.A7 J1.B7), mcu (U4.13)
D_PLU: Power (J1.A6 J1.B6), mcu (U4.14)
IO9: Sensors (U6.16), mcu (U4.21)
IO10: Sensors (U6.15), mcu (U4.20)
IO11: Sensors (U6.9), mcu (U4.18)
IO12: Sensors (U6.10), mcu (U4.17)
IO13: Sensors (U6.1), mcu (U4.19)
SCL: Sensors (P4.3 U8.13), mcu (J5.13 R15.2 U4.24)
SCL_2: Sensors (P5.4 U7.4), mcu (R20.2 U4.22)
SDA: Sensors (P4.4 U8.14), mcu (J5.12 R14.2 U4.35)
SDA_2: Sensors (P5.3 U7.3), mcu (R19.2 U4.38)
TAP_INT: Sensors (U8.4), mcu (U4.39)